# Altium project USB_ETH_PRJ.PrjPcb
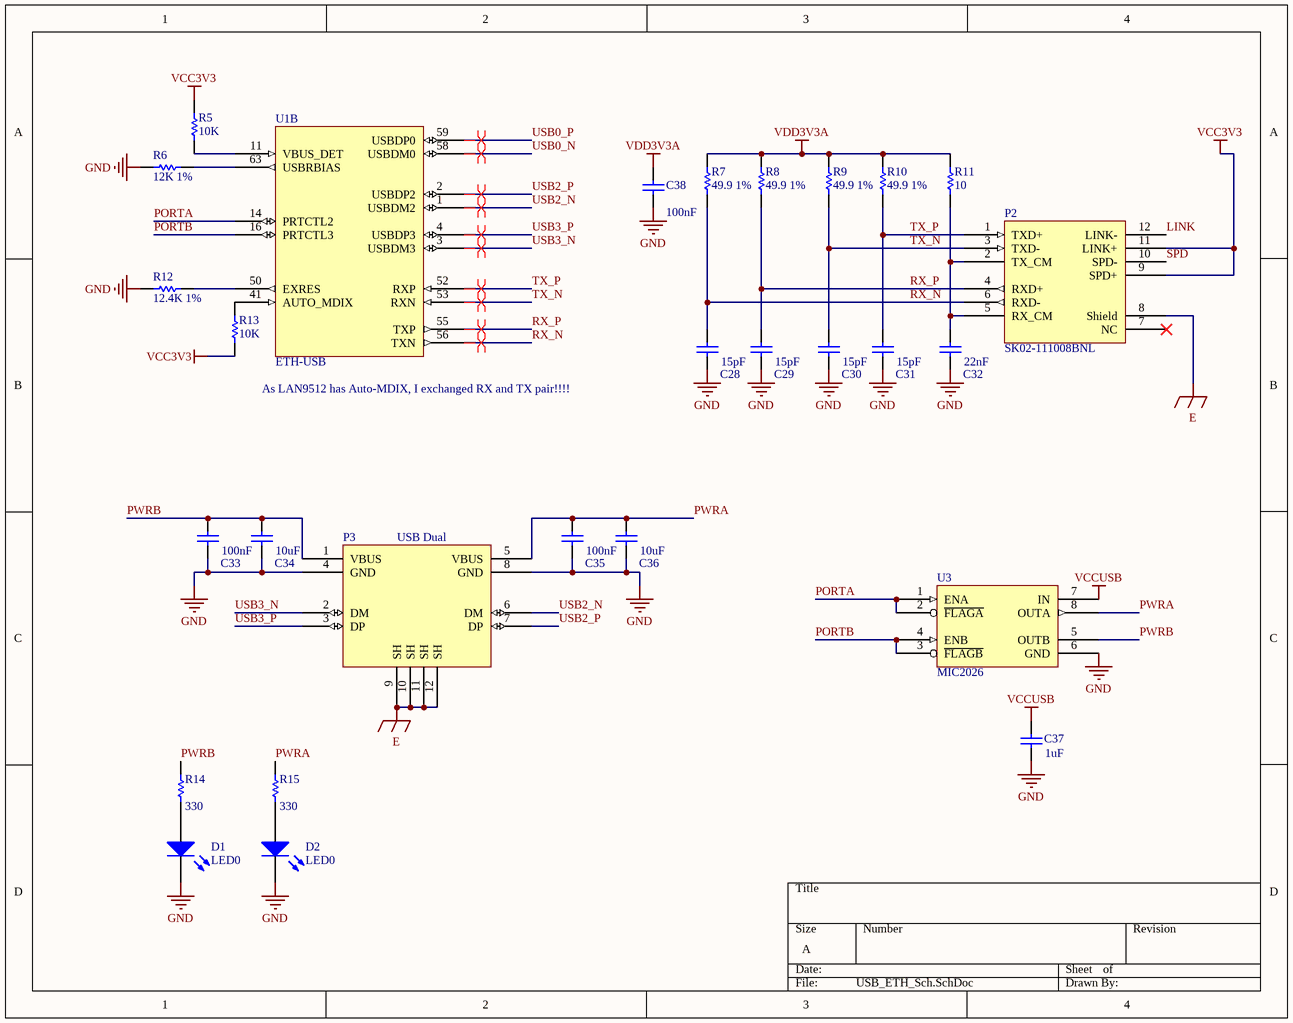
[diagram p0: USB_ETH_Sch.SchDoc]
2 sheets, 67 parts. Net scope: global (net labels, ports and power ports of the same name join across sheets).
Board file: LAN9512_pcb.PcbDoc
Sheets:
  USB_ETH_Sch.SchDoc
  Schematic_1.SchDoc

## Sheet USB_ETH_Sch.SchDoc
size A; PageSetup: Record=PageOptions|CenterHorizontal=True|CenterVertical=True|PrintScale=1.11|XCorrection=1.00|YCorrection=1.00|PrintKind=0|BorderSize=5000000|LeftOffset=0|BottomOffset=0|Orientation=2|PaperLength=1000|PaperWidth=1000|Scale=100|PaperSource=7|PrintQuality=-4|MediaType=1|DitherType=10|PaperKind=Letter|PrintScaleMode=1

### Parts
C28  value 15pF  [C0805]  (hidden comment: Cap)
C29  value 15pF  [C0805]  (hidden comment: Cap)
C30  value 15pF  [C0805]  (hidden comment: Cap)
C31  value 15pF  [C0805]  (hidden comment: Cap)
C32  value 22nF  [C0805]  (hidden comment: Cap)
C33  value 100nF  [C0805]  (hidden comment: Cap)
C34  value 10uF  [C0805]  (hidden comment: Cap)
C35  value 100nF  [C0805]  (hidden comment: Cap)
C36  value 10uF  [C0805]  (hidden comment: Cap)
C37  value 1uF  [C0805]  (hidden comment: Cap)
C38  value 100nF  [C0805]  (hidden comment: Cap)
D1  LED0  [SMD_LED_1206]
D2  LED0  [SMD_LED_1206]
P2  SK02-111008BNL  [RJ45+MAG]
P3  USB Dual  [USB_Duble]
R5  value 10K  [c0805]  (hidden comment: Res1)
R6  value 12K 1%  [c0805]  (hidden comment: Res1)
R7  value 49.9 1%  [c0805]  (hidden comment: Res1)
R8  value 49.9 1%  [c0805]  (hidden comment: Res1)
R9  value 49.9 1%  [c0805]  (hidden comment: Res1)
R10  value 49.9 1%  [c0805]  (hidden comment: Res1)
R11  value 10  [c0805]  (hidden comment: Res1)
R12  value 12.4K 1%  [c0805]  (hidden comment: Res1)
R13  value 10K  [c0805]  (hidden comment: Res1)
R14  value 330  [C1206]  (hidden comment: Res1)
R15  value 330  [C1206]  (hidden comment: Res1)
U1  ETH-USB  [QFN64]  (part B of 3)
U3  MIC2026  [SSOP8]

### Nets
E: P2.8(Shield) P3.9(SH) P3.10(SH) P3.11(SH) P3.12(SH)
GND: C28.1 C29.1 C30.1 C31.1 C32.1 C33.1 C34.1 C35.1 C36.1 C37.1 C38.1 D1.2(K) D2.2(K) P3.4(GND) P3.8(GND) R6.1 R12.1 U3.6(GND)
VCC3V3: P2.9(SPD+) P2.11(LINK+) R5.1 R13.1
VCCUSB: C37.2 U3.7(IN)
VDD3V3A: C38.2 R7.2 R8.2 R9.2 R10.2 R11.2
LINK: P2.12(LINK-)
PORTA: U1.14(PRTCTL2) U3.1(ENA) U3.2(~{FLAGA})
PORTB: U1.16(PRTCTL3) U3.3(~{FLAGB}) U3.4(ENB)
PWRA: C35.2 C36.2 P3.5(VBUS) R15.2 U3.8(OUTA)
PWRB: C33.2 C34.2 P3.1(VBUS) R14.2 U3.5(OUTB)
RX_N: C28.2 P2.6(RXD-) R7.1 U1.56(TXN)
RX_P: C29.2 P2.4(RXD+) R8.1 U1.55(TXP)
SPD: P2.10(SPD-)
TX_N: C30.2 P2.3(TXD-) R9.1 U1.53(RXN)
TX_P: C31.2 P2.1(TXD+) R10.1 U1.52(RXP)
USB0_N: U1.58(USBDM0)
USB0_P: U1.59(USBDP0)
USB2_N: P3.6(DM) U1.1(USBDM2)
USB2_P: P3.7(DP) U1.2(USBDP2)
USB3_N: P3.2(DM) U1.3(USBDM3)
USB3_P: P3.3(DP) U1.4(USBDP3)
NetC32_2: C32.2 P2.2(TX_CM) P2.5(RX_CM) R11.1
NetD1_1: D1.1(A) R14.1
NetD2_1: D2.1(A) R15.1
NetR5_2: R5.2 U1.11(VBUS_DET)
NetR6_2: R6.2 U1.63(USBRBIAS)
NetR12_2: R12.2 U1.50(EXRES)
NetR13_2: R13.2 U1.41(AUTO_MDIX)

Not connected (* = marked no-connect by the designer): P2 7(NC)*

### Layout directives
differential pair: RX_N, RX_P, TX_N, TX_P, USB0_N, USB0_P, USB2_N, USB2_P, USB3_N, USB3_P

### Notes on the sheet
- As LAN9512 has Auto-MDIX, I exchanged RX and TX pair!!!!

### Library data of the parts
C28-C38 = Cap: Capacitor; Published: 8-Jun-2000; LatestRevisionDate: 17-Jul-2002; LatestRevisionNote: Re-released for DXP Platform.; PackageReference: RAD-0.3; Publisher: Altium Limited; PackageDescription: Radial Cap, Thru-Hole; 2 Leads; 0.3 in Pin Spacing
D1 D2 = LED0: Typical INFRARED GaAs LED; Published: 8-Jun-2000; LatestRevisionDate: 08-Jul-2005; LatestRevisionNote: Mech Layer 1 removed.; PackageReference: LED-0; Publisher: Altium Limited; PackageDescription: LED; 2 Leads
P2 = SK02-111008BNL: Ethernet
P3 = USB_Double_Female
R5-R15 = Res1: Resistor; Published: 8-Jun-2000; LatestRevisionDate: 17-Jul-2002; LatestRevisionNote: Re-released for DXP Platform.; PackageReference: AXIAL-0.3; Publisher: Altium Limited; PackageDescription: Axial Device, Thru-Hole; 2 Leads; 0.3 in Pin Spacing
U1 = LAN9512: USB Hub to LAN connevtor

## Sheet Schematic_1.SchDoc
size A; PageSetup: Record=PageOptions|CenterHorizontal=True|CenterVertical=True|PrintScale=1.11|XCorrection=1.00|YCorrection=1.00|PrintKind=0|BorderSize=5000000|LeftOffset=0|BottomOffset=0|Orientation=2|PaperLength=1000|PaperWidth=1000|Scale=100|PaperSource=7|PrintQuality=-4|MediaType=1|DitherType=10|PaperKind=Letter|PrintScaleMode=1
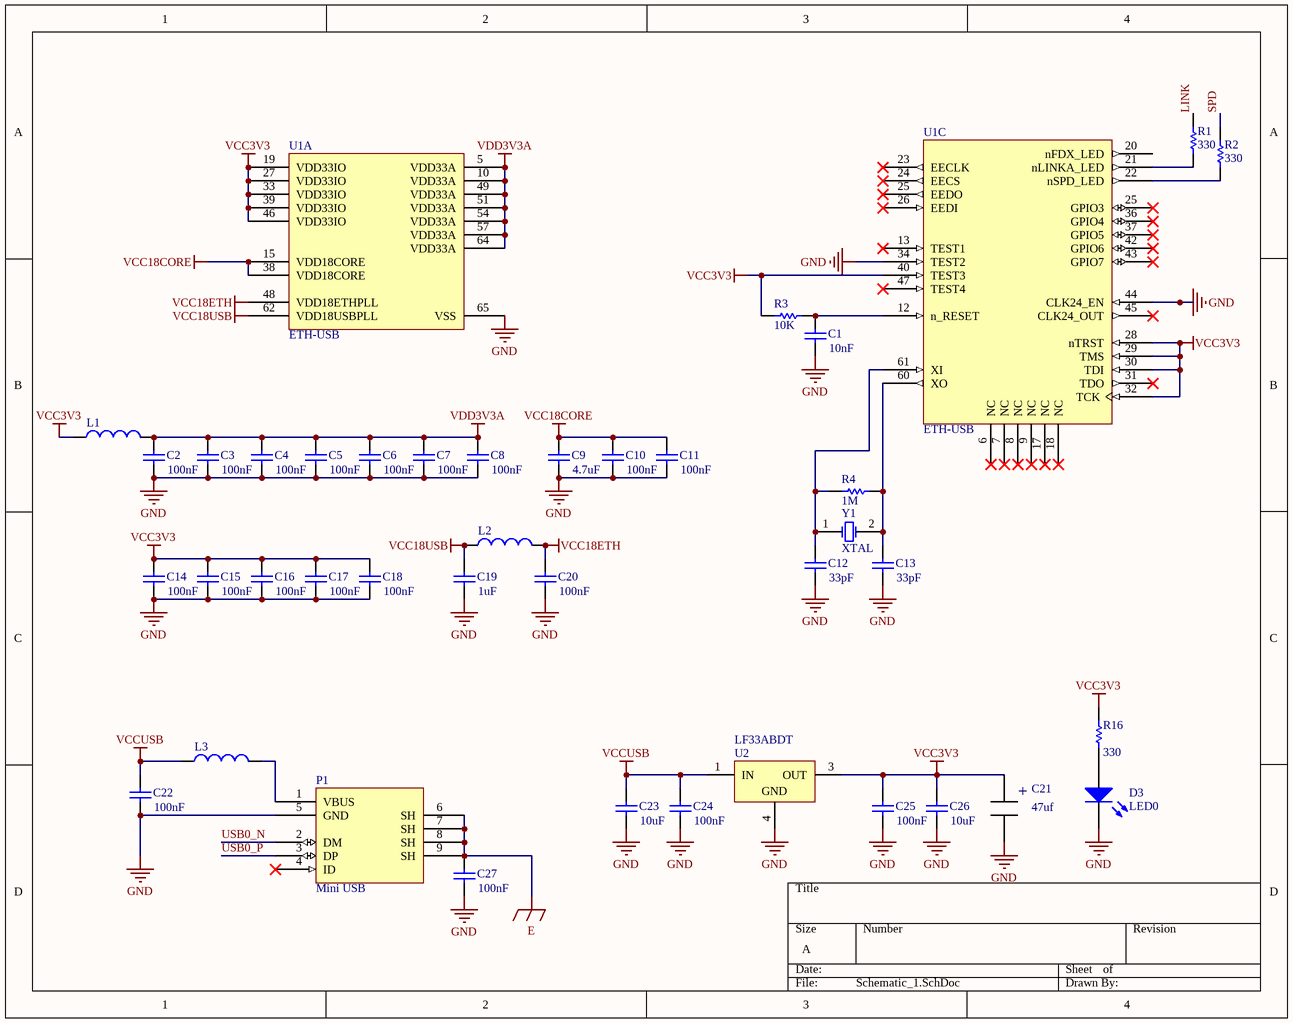
[diagram p1: Schematic_1.SchDoc]

### Parts
C1  value 10nF  [C0805]  (hidden comment: Cap)
C2  value 100nF  [C0805]  (hidden comment: Cap)
C3  value 100nF  [C0805]  (hidden comment: Cap)
C4  value 100nF  [C0805]  (hidden comment: Cap)
C5  value 100nF  [C0805]  (hidden comment: Cap)
C6  value 100nF  [C0805]  (hidden comment: Cap)
C7  value 100nF  [C0805]  (hidden comment: Cap)
C8  value 100nF  [C0805]  (hidden comment: Cap)
C9  value 4.7uF  [C0805]  (hidden comment: Cap)
C10  value 100nF  [C0805]  (hidden comment: Cap)
C11  value 100nF  [C0805]  (hidden comment: Cap)
C12  value 33pF  [C0805]  (hidden comment: Cap)
C13  value 33pF  [C0805]  (hidden comment: Cap)
C14  value 100nF  [C0805]  (hidden comment: Cap)
C15  value 100nF  [C0805]  (hidden comment: Cap)
C16  value 100nF  [C0805]  (hidden comment: Cap)
C17  value 100nF  [C0805]  (hidden comment: Cap)
C18  value 100nF  [C0805]  (hidden comment: Cap)
C19  value 1uF  [C0805]  (hidden comment: Cap)
C20  value 100nF  [C0805]  (hidden comment: Cap)
C21  value 47uf  [Capacitor]  (hidden comment: Capacitor)
C22  value 100nF  [C0805]  (hidden comment: Cap)
C23  value 10uF  [C0805]  (hidden comment: Cap)
C24  value 100nF  [C0805]  (hidden comment: Cap)
C25  value 100nF  [C0805]  (hidden comment: Cap)
C26  value 10uF  [C0805]  (hidden comment: Cap)
C27  value 100nF  [C0805]  (hidden comment: Cap)
D3  LED0  [SMD_LED_1206]
L1  Inductor  [C1206]  (value not drawn)
L2  Inductor  [C0805]  (value not drawn)
L3  Inductor  [C1206]  (value not drawn)
P1  Mini USB  [Mini USB]
R1  value 330  [c0805]  (hidden comment: Res1)
R2  value 330  [c0805]  (hidden comment: Res1)
R3  value 10K  [c0805]  (hidden comment: Res1)
R4  value 1M  [c0805]  (hidden comment: Res1)
R16  value 330  [C1206]  (hidden comment: Res1)
U1  ETH-USB  [QFN64]  (parts A,C of 3)
U2  LF33ABDT  [LF33-TO-252]
Y1  XTAL  [SMD_Crystal]

### Nets
E: C27.2 P1.6(SH) P1.7(SH) P1.8(SH) P1.9(SH)
GND: C1.1 C2.1 C3.1 C4.1 C5.1 C6.1 C7.1 C8.1 C9.1 C10.1 C11.1 C12.1 C13.1 C14.1 C15.1 C16.1 C17.1 C18.1 C19.1 C20.1 C21.1 C22.1 C23.1 C24.1 C25.1 C26.1 C27.1 D3.2(K) P1.5(GND) U1.34(TEST2) U1.44(CLK24_EN) U1.65(VSS) U2.4(GND)
VCC3V3: C14.2 C15.2 C16.2 C17.2 C18.2 C21.2 C25.2 C26.2 L1.1 R3.2 R16.2 U1.19(VDD33IO) U1.27(VDD33IO) U1.28(nTRST) U1.29(TMS) U1.30(TDI) U1.32(TCK) U1.33(VDD33IO) U1.39(VDD33IO) U1.40(TEST3) U1.46(VDD33IO) U2.3(OUT)
VCC18CORE: C9.2 C10.2 C11.2 U1.15(VDD18CORE) U1.38(VDD18CORE)
VCC18ETH: C20.2 L2.2 U1.48(VDD18ETHPLL)
VCC18USB: C19.2 L2.1 U1.62(VDD18USBPLL)
VCCUSB: C22.2 C23.2 C24.2 L3.1 U2.1(IN)
VDD3V3A: C2.2 C3.2 C4.2 C5.2 C6.2 C7.2 C8.2 L1.2 U1.5(VDD33A) U1.10(VDD33A) U1.49(VDD33A) U1.51(VDD33A) U1.54(VDD33A) U1.57(VDD33A) U1.64(VDD33A)
LINK: R1.1
SPD: R2.1
USB0_N: P1.2(DM)
USB0_P: P1.3(DP)
NetC1_2: C1.2 R3.1 U1.12(n_RESET)
NetC12_2: C12.2 R4.2 U1.61(XI) Y1.1(OSC1)
NetC13_2: C13.2 R4.1 U1.60(XO) Y1.2(OSC2)
NetD3_1: D3.1(A) R16.1
NetL3_2: L3.2 P1.1(VBUS)
NetR1_2: R1.2 U1.21(nLINKA_LED)
NetR2_2: R2.2 U1.22(nSPD_LED)

Not connected (* = marked no-connect by the designer): P1 4(ID)*; U1 6(NC)* 7(NC)* 8(NC)* 9(NC)* 13(TEST1)* 17(NC)* 18(NC)* 20(nFDX_LED) 23(EECLK)* 24(EECS)* 25(EEDO)* 26(EEDI)* 31(TDO)* 36(GPIO4)* 37(GPIO5)* 42(GPIO6)* 43(GPIO7)* 45(CLK24_OUT)* 47(TEST4)*

### Notes on the sheet
- (in symbol SMS capacitor) +

### Library data of the parts
C1-C20 C22-C27 = Cap: Capacitor; Published: 8-Jun-2000; LatestRevisionDate: 17-Jul-2002; LatestRevisionNote: Re-released for DXP Platform.; PackageReference: RAD-0.3; Publisher: Altium Limited; PackageDescription: Radial Cap, Thru-Hole; 2 Leads; 0.3 in Pin Spacing
C21 = SMS capacitor
D3 = LED0: Typical INFRARED GaAs LED; Published: 8-Jun-2000; LatestRevisionDate: 08-Jul-2005; LatestRevisionNote: Mech Layer 1 removed.; PackageReference: LED-0; Publisher: Altium Limited; PackageDescription: LED; 2 Leads
L1-L3 = Inductor: Code_IEC: 1005; Value: 10mH; Published: 8-Jun-2000; LatestRevisionDate: 29-May-2009; LatestRevisionNote: IPC-7351 Footprint Added.; PackageReference: 0402-A; Publisher: Altium Limited; PackageDescription: Chip Inductor; Code_JEITA: 0402
R1-R4 R16 = Res1: Resistor; Published: 8-Jun-2000; LatestRevisionDate: 17-Jul-2002; LatestRevisionNote: Re-released for DXP Platform.; PackageReference: AXIAL-0.3; Publisher: Altium Limited; PackageDescription: Axial Device, Thru-Hole; 2 Leads; 0.3 in Pin Spacing
U1 = LAN9512: USB Hub to LAN connevtor
U2 = LF33ABDT: 500mA, Very Low Drop (0.45V) Voltage Regulator; Published: 24-Aug-2001; LatestRevisionDate: 06-Jun-2005; LatestRevisionNote: PCB pads lengthened.; DatasheetVersion: Feb-2004; PackageVersion: Jun-2004; PackageReference: TO-252; Publisher: Altium Limited; PackageDescription: D-PAK/TO-252-AA; 3 Leads (1 Cropped); Body 10.1 (inc. leads) x 6.6 mm (LxW max); ComponentLink1Description: Manufacturer Link; ComponentLink1URL: http://www.st.com/; ComponentLink2Description: Datasheet; ComponentLink2URL: http://www.st.com/stonline/books/pdf/docs/2574.pdf
Y1 = XTAL: Crystal Oscillator; Published: 8-Jun-2000; LatestRevisionDate: 17-Jul-2002; LatestRevisionNote: Re-released for DXP Platform.; PackageReference: R38; Publisher: Altium Limited; PackageDescription: Crystal, Thru-Hole; 2 Leads; Body 3.1 x 8.2 mm (Dia.xH)

## Nets that join several sheets
E: USB_ETH_Sch (5 pins), Schematic_1 (5 pins)
GND: USB_ETH_Sch (18 pins), Schematic_1 (33 pins)
VCC3V3: USB_ETH_Sch (P2.9 P2.11 R5.1 R13.1), Schematic_1 (22 pins)
VCCUSB: USB_ETH_Sch (C37.2 U3.7), Schematic_1 (5 pins)
VDD3V3A: USB_ETH_Sch (6 pins), Schematic_1 (15 pins)
LINK: USB_ETH_Sch (P2.12), Schematic_1 (R1.1)
SPD: USB_ETH_Sch (P2.10), Schematic_1 (R2.1)
USB0_N: USB_ETH_Sch (U1.58), Schematic_1 (P1.2)
USB0_P: USB_ETH_Sch (U1.59), Schematic_1 (P1.3)